# EAGLE design proton_pack_neopixel_driver (EAGLE 8.3.1)
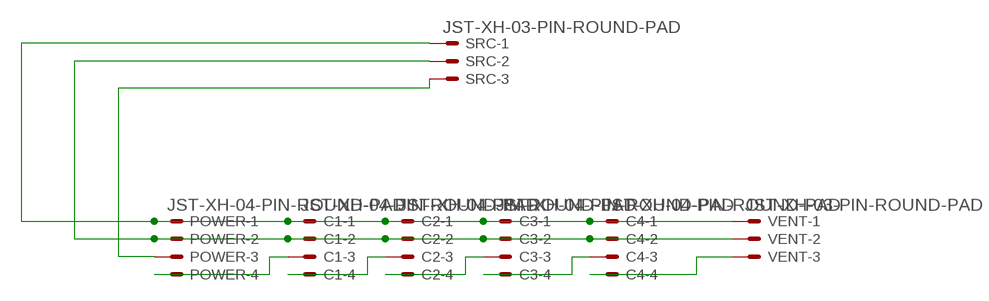
[diagram p0: schematic, sheet 1]

## Parts
C1  JST-XH-04-PIN-ROUND-PAD  [JST-XH-04-PACKAGE-ROUND-PAD]
C2  JST-XH-04-PIN-ROUND-PAD  [JST-XH-04-PACKAGE-ROUND-PAD]
C3  JST-XH-04-PIN-ROUND-PAD  [JST-XH-04-PACKAGE-ROUND-PAD]
C4  JST-XH-04-PIN-ROUND-PAD  [JST-XH-04-PACKAGE-ROUND-PAD]
POWER  JST-XH-04-PIN-ROUND-PAD  [JST-XH-04-PACKAGE-ROUND-PAD]
SRC  JST-XH-03-PIN-ROUND-PAD  [JST-XH-03-PACKAGE-ROUND-PAD]
VENT  JST-XH-03-PIN-ROUND-PAD  [JST-XH-03-PACKAGE-ROUND-PAD]

## Nets
N$1: C1.3 POWER.4
N$2: C1.4 C2.3
N$3: C2.4 C3.3
N$4: C3.4 C4.3
N$5: C4.4 VENT.3
N$6: C1.2 C2.2 C3.2 C4.2 POWER.2 SRC.2 VENT.2
N$8: C1.1 C2.1 C3.1 C4.1 POWER.1 SRC.1 VENT.1
N$9: POWER.3 SRC.3

## Library data of the parts
C1-C4 POWER = Rembrandt Electronics - JST XH Connectors v1-0:JST-XH-04-PIN: JST XH Connector 2 Pin Wire to board connector. Pitch: 2,54 mm, (0.100") Number of pins: 4 Created by Rembrandt Electronics www.rembrandtelectronics.com
SRC VENT = Rembrandt Electronics - JST XH Connectors v1-0:JST-XH-03-PIN: JST XH Connector 2 Pin Wire to board connector. Pitch: 2,54 mm, (0.100") Number of pins: 3 Created by Rembrandt Electronics www.rembrandtelectronics.com

## Board
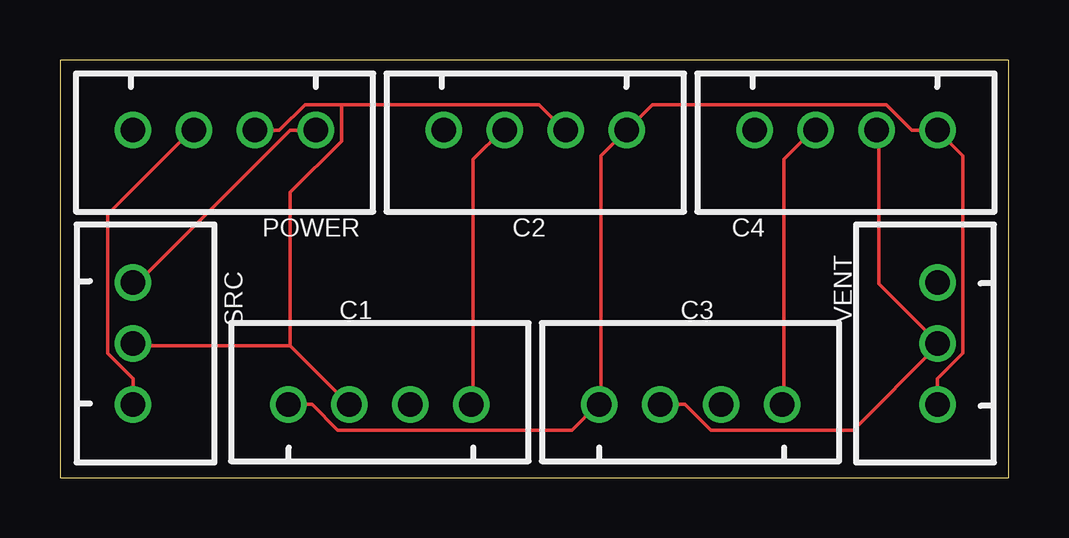
[diagram p1: board, top side]
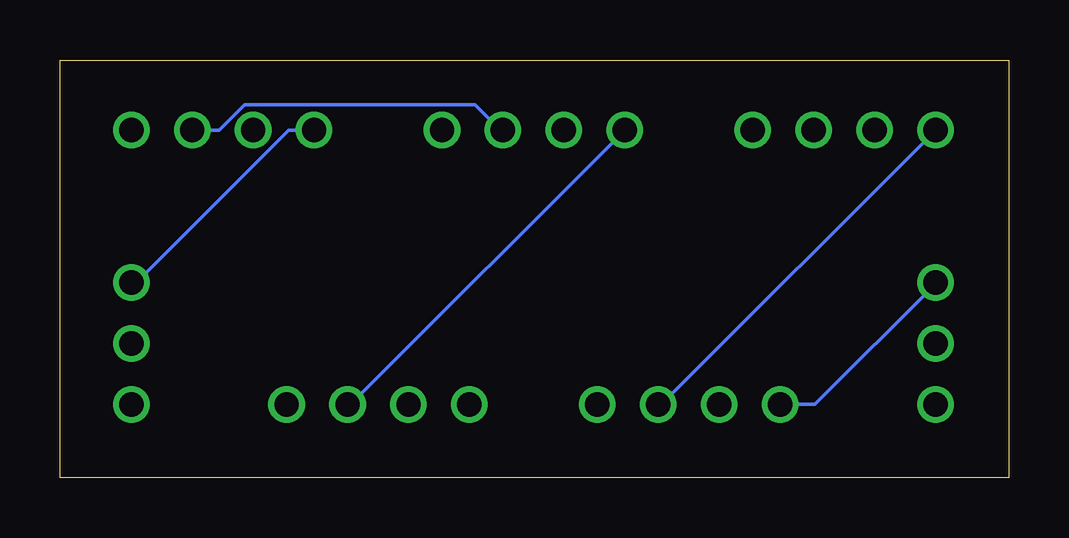
[diagram p2: board, bottom side, seen from below]

Size 39.55 x 17.4 mm. Coordinates in mm from the lower left corner, seen from the top.
Outline: 0,0 39.55,0 39.55,17.4 0,17.4 0,0
Copper layers (1*16): Top 0.0356mm / dielectric 1.5011mm / Bottom 0.0356mm
Design rules "oshpark-2layer": minimum track width 6mil, minimum drill 13mil, track to track 6mil, track to pad 6mil, pad to pad 6mil, via to via 6mil, smd to smd 6mil, copper to edge 15mil, drill to drill 6mil, minimum pad ring 7mil, minimum via ring 7mil, stop-mask expansion 2.5mil, vias tented up to drill 0mil, thermal gap 10mil

### Footprints (pad centres in the part's own frame; a part is rotated, then mirrored left to right if it is on the bottom)
JST-XH-04-PACKAGE-ROUND-PAD = drill 1.016: 1 -3.81,0; 2 -1.27,0; 3 1.27,0; 4 3.81,0
JST-XH-03-PACKAGE-ROUND-PAD = drill 1.016: 1 -2.54,0; 2 0,0; 3 2.54,0

### Placement (x,y rotation side)
C1  13.33,3.05 0 top
C2  19.81,14.48 180 top
C3  26.29,3.05 0 top
C4  32.77,14.48 180 top
POWER  6.86,14.48 180 top
SRC  3.05,5.59 270 top
VENT  36.58,5.59 90 top

### Tracks (layer width: path | path; a pad name or v marks a point on that pad's centre or on a via)
N$1
  Bottom 0.152: POWER.4 14.48,3.05 C1.3
N$2
  Top 0.152: C1.4 17.22,3.05 17.22,13.26 18.44,14.48 C2.3
N$3
  Bottom 0.152: C2.4 27.43,3.05 C3.3
N$4
  Top 0.152: C3.4 30.18,3.05 30.18,13.26 31.39,14.48 C4.3
N$5
  Bottom 0.152: C4.4 30.02,14.48 36.27,8.23 36.58,8.23 VENT.3
N$6
  Top 0.152: C3.2 26.06,3.05 27.13,1.98 33.07,1.98 36.58,5.49 VENT.2 36.58,5.64 34.14,8.08 34.14,14.48 C4.2 | 9.6,5.49 3.05,5.49 SRC.2 | 9.6,5.49 12.04,3.05 C1.2 | POWER.2 9.14,14.48 10.21,15.54 11.73,15.54 | 11.73,15.54 19.96,15.54 21.03,14.48 C2.2 | 9.6,5.49 9.6,11.89 11.73,14.02 11.73,15.54
  Bottom 0.152: C4.2 32.92,14.48 31.85,15.54 22.25,15.54 21.18,14.48 C2.2
N$8
  Top 0.152: POWER.1 9.6,14.48 3.35,8.23 3.05,8.23 SRC.1 | VENT.1 36.58,4.12 37.64,5.18 37.64,13.41 C4.1 35.51,14.48 34.44,15.54 24.69,15.54 C2.1 22.55,13.41 22.55,3.05 C3.1 22.4,3.05 21.34,1.98 11.58,1.98 10.52,3.05 C1.1
  Bottom 0.152: C1.1 8.08,3.05 3.05,8.08 SRC.1
N$9
  Top 0.152: SRC.3 3.05,4.12 1.98,5.18 1.98,10.97 5.49,14.48 POWER.3

### Text on the board
bOrigins: Pack Lights V1